# Altium project Battman.PrjPcb
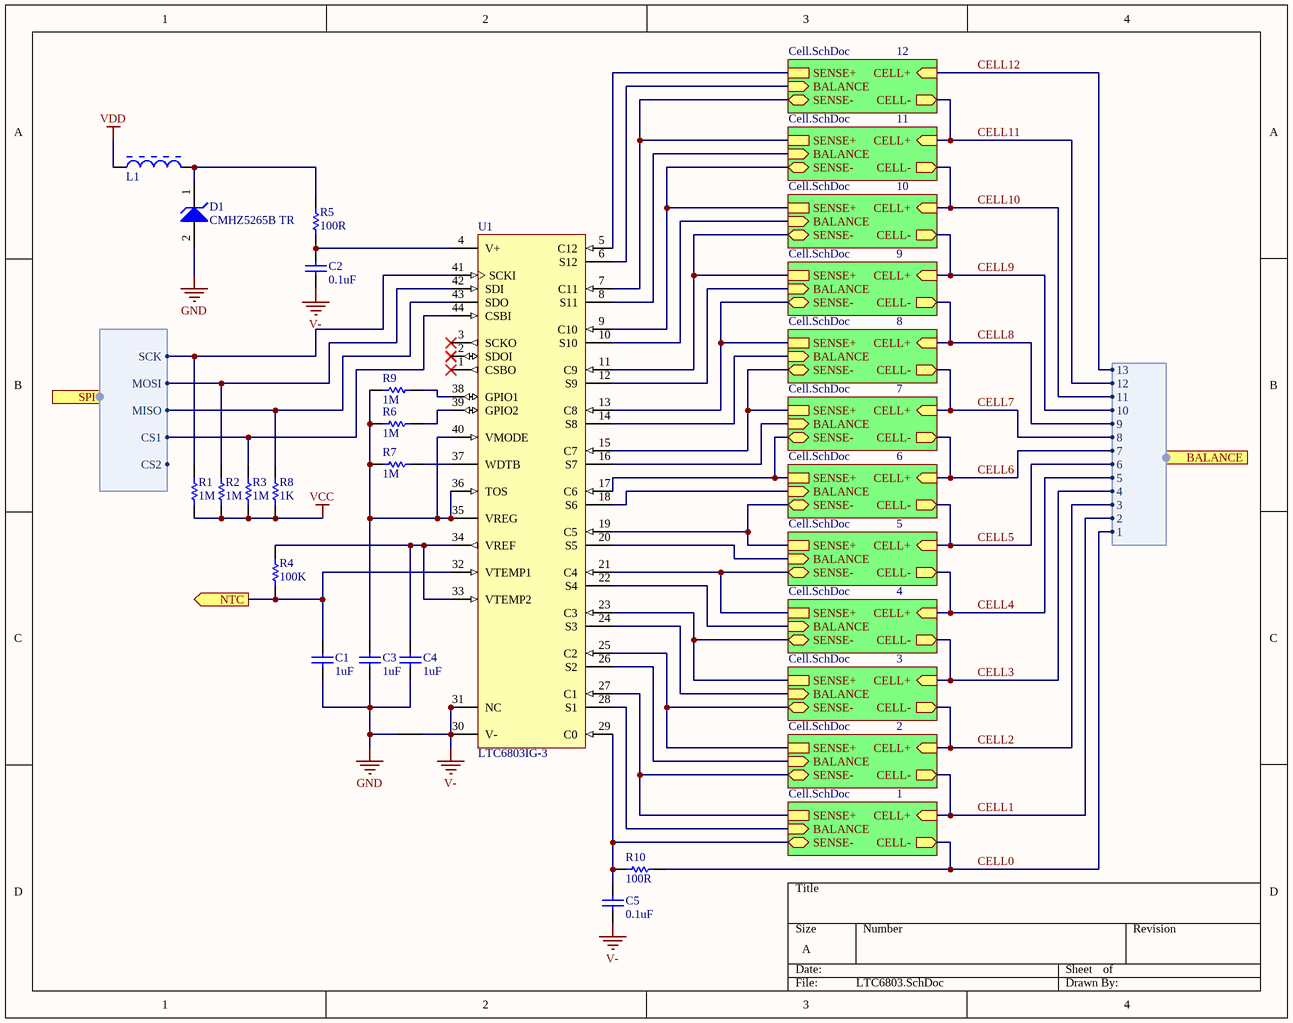
[diagram p0: LTC6803.SchDoc]
2 sheets, 39 parts. Net scope: hierarchical (ports join the sheet entries above them; power ports are global).
Board file: BMS.PcbDoc
Sheets:
  LTC6803.SchDoc
  3V3.SchDoc

## Sheet LTC6803.SchDoc
size A; SheetNumber: 4

### Parts
*  NetTie  [NetTie]  (value not drawn)  (net tie, no BOM)
C1  value 1uF  [C0402[1005X55]]  (hidden comment: 1uF 6.3V 0402)
C2  value 0.1uF  [C0402[1005X55]]  (hidden comment: 0.1uF 100V 0402)
C3  value 1uF  [C0402[1005X55]]  (hidden comment: 1uF 6.3V 0402)
C4  value 1uF  [C0402[1005X55]]  (hidden comment: 1uF 6.3V 0402)
C5  value 0.1uF  [C0402[1005X55]]  (hidden comment: 0.1uF 6.3V 0402)
D1  CMHZ5265B TR  [SOD-123]
L1  MURA-FB-2  [MURA-BLM31-B60-CHIP-2_V3]  (value not drawn)
R1  value 1M  [R0402[1005]]  (hidden comment: 1M 1% 0402)
R2  value 1M  [R0402[1005]]  (hidden comment: 1M 1% 0402)
R3  value 1M  [R0402[1005]]  (hidden comment: 1M 1% 0402)
R4  value 100K  [R0402[1005]]  (hidden comment: 100K 1% 0402)
R5  value 100R  [R0402[1005]]  (hidden comment: 100R 1% 0402)
R6  value 1M  [R0402[1005]]  (hidden comment: 1M 1% 0402)
R7  value 1M  [R0402[1005]]  (hidden comment: 1M 1% 0402)
R8  value 1K  [R0402[1005]]  (hidden comment: 1K 1% 0402)
R9  value 1M  [R0402[1005]]  (hidden comment: 1M 1% 0402)
R10  value 100R  [R0402[1005]]  (hidden comment: 100R 1% 0402)
U1  LTC6803IG-3  [TSSOP-44]

### Sub-sheets
1 = Cell.SchDoc (file not in this document): SENSE+, SENSE- (bidir), BALANCE (in), CELL+ (in), CELL- (out)
2 = Cell.SchDoc (file not in this document): SENSE+, SENSE- (bidir), BALANCE (in), CELL+ (in), CELL- (out)
3 = Cell.SchDoc (file not in this document): SENSE+, SENSE- (bidir), BALANCE (in), CELL+ (in), CELL- (out)
4 = Cell.SchDoc (file not in this document): SENSE+, SENSE- (bidir), BALANCE (in), CELL+ (in), CELL- (out)
5 = Cell.SchDoc (file not in this document): SENSE+, SENSE- (bidir), BALANCE (in), CELL+ (in), CELL- (out)
6 = Cell.SchDoc (file not in this document): SENSE+, SENSE- (bidir), BALANCE (in), CELL+ (in), CELL- (out)
7 = Cell.SchDoc (file not in this document): SENSE+, SENSE- (bidir), BALANCE (in), CELL+ (in), CELL- (out)
8 = Cell.SchDoc (file not in this document): SENSE+, SENSE- (bidir), BALANCE (in), CELL+ (in), CELL- (out)
9 = Cell.SchDoc (file not in this document): SENSE+, SENSE- (bidir), BALANCE (in), CELL+ (in), CELL- (out)
10 = Cell.SchDoc (file not in this document): SENSE+, SENSE- (bidir), BALANCE (in), CELL+ (in), CELL- (out)
11 = Cell.SchDoc (file not in this document): SENSE+, SENSE- (bidir), BALANCE (in), CELL+ (in), CELL- (out)
12 = Cell.SchDoc (file not in this document): SENSE+, SENSE- (bidir), BALANCE (in), CELL+ (in), CELL- (out)

### Ports
BALANCE (harness Balance), NTC (out), SPI (harness SPI)

### Harnesses
SPI: SCK, MOSI, MISO, CS1, CS2
Balance: 13, 12, 11, 10, 9, 8, 6, 7, 5, 3, 4, 2, 1

### Nets
GND: *.1 C1.1 C3.1 C4.1 D1.2(A)
V-: *.2 C2.1 C5.1 U1.30(V-) U1.31(NC)
VCC: R1.1 R2.1 R3.1 R8.2
VDD: L1.1
CELL0: R10.2 ; sheet 1/CELL-, port BALANCE.1
CELL1: sheet 2/CELL-, sheet 1/CELL+, port BALANCE.2
CELL2: sheet 3/CELL-, sheet 2/CELL+, port BALANCE.3
CELL3: sheet 4/CELL-, sheet 3/CELL+, port BALANCE.4
CELL4: sheet 5/CELL-, sheet 4/CELL+, port BALANCE.5
CELL5: sheet 6/CELL-, sheet 5/CELL+, port BALANCE.6
CELL6: sheet 7/CELL-, sheet 6/CELL+, port BALANCE.7
CELL7: sheet 8/CELL-, sheet 7/CELL+, port BALANCE.8
CELL8: sheet 9/CELL-, sheet 8/CELL+, port BALANCE.9
CELL9: sheet 10/CELL-, sheet 9/CELL+, port BALANCE.10
CELL10: sheet 11/CELL-, sheet 10/CELL+, port BALANCE.11
CELL11: sheet 12/CELL-, sheet 11/CELL+, port BALANCE.12
CELL12: sheet 12/CELL+, port BALANCE.13
NetC1_2: C1.2 R4.1 U1.32(VTEMP1) ; port NTC
NetC2_2: C2.2 R5.1 U1.4(V+)
NetC3_2: C3.2 R6.2 R7.2 R9.2 U1.35(VREG) U1.36(TOS) U1.40(VMODE)
NetC4_2: C4.2 R4.2 U1.33(VTEMP2) U1.34(VREF)
NetC5_2: C5.2 R10.1 U1.29(C0) ; sheet 1/SENSE-
NetD1_1: D1.1(K) L1.2 R5.2
NetR1_2: R1.2 U1.41(SCKI) ; port SPI.SCK
NetR2_2: R2.2 U1.42(SDI) ; port SPI.MOSI
NetR3_2: R3.2 U1.44(CSBI) ; port SPI.CS1
NetR6_1: R6.1 U1.39(GPIO2)
NetR7_1: R7.1 U1.37(WDTB)
NetR8_1: R8.1 U1.43(SDO) ; port SPI.MISO
NetR9_1: R9.1 U1.38(GPIO1)
NetU1_5: U1.5(C12) ; sheet 12/SENSE+
NetU1_6: U1.6(S12) ; sheet 12/BALANCE
NetU1_7: U1.7(C11) ; sheet 12/SENSE-, sheet 11/SENSE+
NetU1_8: U1.8(S11) ; sheet 11/BALANCE
NetU1_9: U1.9(C10) ; sheet 11/SENSE-, sheet 10/SENSE+
NetU1_10: U1.10(S10) ; sheet 10/BALANCE
NetU1_11: U1.11(C9) ; sheet 10/SENSE-, sheet 9/SENSE+
NetU1_12: U1.12(S9) ; sheet 9/BALANCE
NetU1_13: U1.13(C8) ; sheet 9/SENSE-, sheet 8/SENSE+
NetU1_14: U1.14(S8) ; sheet 8/BALANCE
NetU1_15: U1.15(C7) ; sheet 8/SENSE-, sheet 7/SENSE+
NetU1_16: U1.16(S7) ; sheet 7/BALANCE
NetU1_17: U1.17(C6) ; sheet 7/SENSE-, sheet 6/SENSE+
NetU1_18: U1.18(S6) ; sheet 6/BALANCE
NetU1_19: U1.19(C5) ; sheet 6/SENSE-, sheet 5/SENSE+
NetU1_20: U1.20(S5) ; sheet 5/BALANCE
NetU1_21: U1.21(C4) ; sheet 5/SENSE-, sheet 4/SENSE+
NetU1_22: U1.22(S4) ; sheet 4/BALANCE
NetU1_23: U1.23(C3) ; sheet 4/SENSE-, sheet 3/SENSE+
NetU1_24: U1.24(S3) ; sheet 3/BALANCE
NetU1_25: U1.25(C2) ; sheet 3/SENSE-, sheet 2/SENSE+
NetU1_26: U1.26(S2) ; sheet 2/BALANCE
NetU1_27: U1.27(C1) ; sheet 2/SENSE-, sheet 1/SENSE+
NetU1_28: U1.28(S1) ; sheet 1/BALANCE

Not connected (* = marked no-connect by the designer): U1 1(CSBO)* 2(SDOI)* 3(SCKO)*

### Library data of the parts
C1 C3 C4 = CAP_1uF_6.3V_0402_10%: 1uF 6.3V 10% 0402 (1005 Metric); PartNumber: GRM155R70J105KA12D; Manufacturer: Murata; Tolerance: 10%; Mounting Technology: Surface Mount; PackageReference: 0402; PackageDescription: 0402 (1005 Metric); Voltage: 6.3V
C2 = CAP_0.1uF_100V_0402_10%: 0.1uF 100V 10% 0402 (1005 Metric); PartNumber: GRM155R62A104KE14D; Manufacturer: Murata; Tolerance: 10%; Mounting Technology: Surface Mount; PackageReference: 0402; PackageDescription: 0402 (1005 Metric); Voltage: 100V
C5 = CAP_0.1uF_6.3V_0402_10%: 0.1uF 6.3V 10% 0402 (1005 Metric); PartNumber: GRM155R70J104KA01D; Manufacturer: Murata; Tolerance: 10%; Mounting Technology: Surface Mount; PackageReference: 0402; PackageDescription: 0402 (1005 Metric); Voltage: 6.3V
D1 = CMHZ5265B: Zener Diodes 500mW Zener Diode 185mA 58.9V to 2V; Manufacturer: Central Semiconductor; PartNumber: CMHZ5265B TR; Mounting Technology: Surface Mount; PackageReference: SOD-123; PackageDescription: SOD, 2-Leads, Body 2.69x1.6mm
L1 = MURA-FB-2: EMI Filter Beads, Chips & Arrays 1206 33 OHM; PartNumber: BLM31PG330SN1L; Manufacturer: Murata; Mounting Technology: Surface Mount; PackageReference: 1206; PackageDescription: 1206 (3216 Metric)
R1-R3 R6 R7 R9 = RES_1M_0402_1%: 1M 0.063W 1% 0402 (1005 Metric); Manufacturer: KOA Speer; PartNumber: RK73H1ETTP1004F; Power: 0.063W; Tolerance: 1%; Mounting Technology: Surface Mount; PackageReference: 0402; PackageDescription: 0402 (1005 Metric); ComponentLink1Description: Datasheet; ComponentLink1URL: http://www.koaspeer.com/catimages/Products/RK73H/RK73H.pdf
R4 = RES_100K_0402_1%: 100K 0.063W 1% 0402 (1005 Metric); Manufacturer: KOA Speer; PartNumber: RK73H1ETTP1003F; Power: 0.063W; Tolerance: 1%; Mounting Technology: Surface Mount; PackageReference: 0402; PackageDescription: 0402 (1005 Metric); ComponentLink1Description: Datasheet; ComponentLink1URL: http://www.koaspeer.com/catimages/Products/RK73H/RK73H.pdf
R5 R10 = RES_100R_0402_1%: 100R 0.063W 1% 0402 (1005 Metric); Manufacturer: KOA Speer; PartNumber: RK73H1ETTP1000F; Power: 0.063W; Tolerance: 1%; Mounting Technology: Surface Mount; PackageReference: 0402; PackageDescription: 0402 (1005 Metric); ComponentLink1Description: Datasheet; ComponentLink1URL: http://www.koaspeer.com/catimages/Products/RK73H/RK73H.pdf
R8 = RES_1K_0402_1%: 1K 0.063W 1% 0402 (1005 Metric); Manufacturer: KOA Speer; PartNumber: RK73H1ETTP1001F; Tolerance: 1%; Power: 0.063W; Mounting Technology: Surface Mount; PackageReference: 0402; PackageDescription: 0402 (1005 Metric); ComponentLink1Description: Datasheet; ComponentLink1URL: http://www.koaspeer.com/catimages/Products/RK73H/RK73H.pdf
U1 = LTC6803IG-3: PartNumber: LTC6803IG-3#PBF; Manufacturer: Linear Technology; PackageReference: TSSOP-44; Mounting Technology: Surface Mount; PackageDescription: SOP, 44-Leads, Body 13.1x5.6mm, Pitch 0.5mm

## Sheet 3V3.SchDoc
size A; SheetNumber: 2
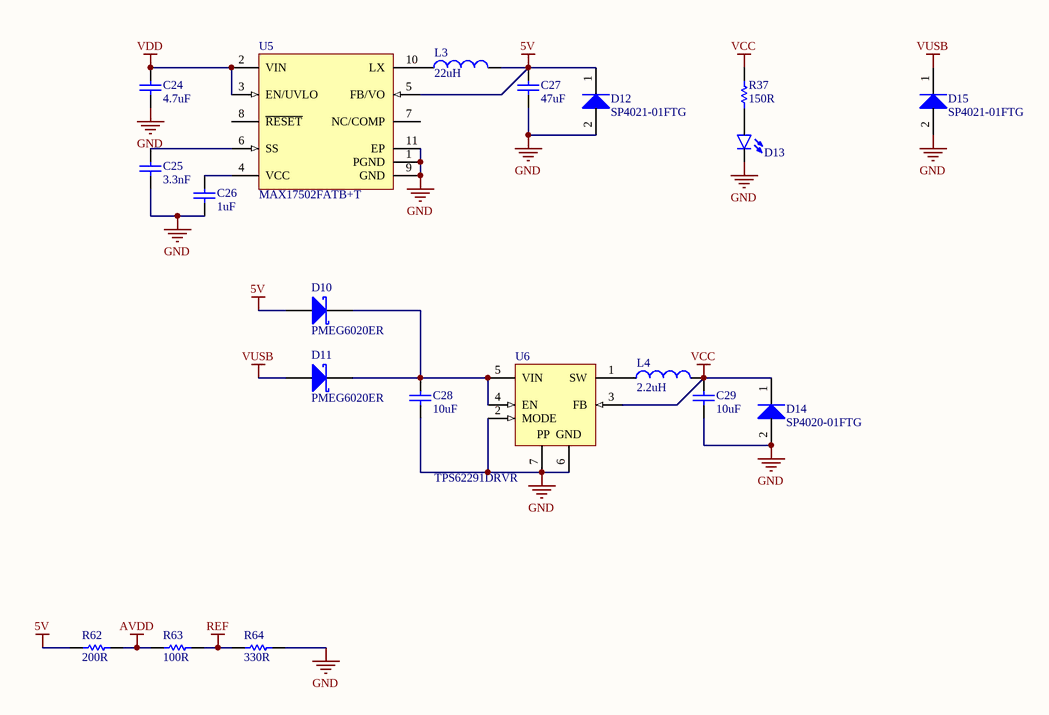
[diagram p1: 3V3.SchDoc]

### Parts
C24  value 4.7uF  [C1210[3225X200]]  (hidden comment: 4.7uF 100V 1210)
C25  value 3.3nF  [C0402[1005X55]]  (hidden comment: 3.3nF 50V 0402)
C26  value 1uF  [C0402[1005X55]]  (hidden comment: 1uF 6.3V 0402)
C27  value 47uF  [C1210[3225X250]]  (hidden comment: 47uF 6.3V 1210)
C28  value 10uF  [C0402[1005X55]]  (hidden comment: 10uF 6.3V 0402)
C29  value 10uF  [C0402[1005X55]]  (hidden comment: 10uF 6.3V 0402)
D10  PMEG6020ER  [SOD-123]
D11  PMEG6020ER  [SOD-123]
D12  SP4021-01FTG  [SOD-323]
D13  LED_0603_GREEN_5mA  [LED0603]  (value not drawn)
D14  SP4020-01FTG  [SOD323]
D15  SP4021-01FTG  [SOD-323]
L3  value 22uH  [SDR0604]
L4  2.2uH  [IND0805]
R37  value 150R  [R0402[1005]]  (hidden comment: 150R 1% 0402)
R62  value 200R  [R0603[1608]]  (hidden comment: 200R 1% 0603)
R63  value 100R  [R0603[1608]]  (hidden comment: 100R 1% 0603)
R64  value 330R  [R0603[1608]]  (hidden comment: 330R 1% 0603)
U5  MAX17502FATB+T  [TDFN-10-EP]
U6  TPS62291DRVR  [WSON-6]

### Nets
5V: C27.2 D10.2(A) D12.1(K) L3.2 R62.1 U5.5(FB/VO)
AVDD: R62.2 R63.1
GND: C24.1 C25.1 C26.1 C27.1 C28.1 C29.1 D12.2(A) D13.C D14.2(A) D15.2(A) R64.2 U5.1(PGND) U5.9(GND) U5.11(EP) U6.2(MODE) U6.6(GND) U6.7(EP)
REF: R63.2 R64.1
VCC: C29.2 D14.1(K) L4.2 R37.2 U6.3(FB)
VDD: C24.2 U5.2(VIN) U5.3(EN/UVLO)
VUSB: D11.2(A) D15.1(K)
NetC25_2: C25.2 U5.6(SS)
NetC26_2: C26.2 U5.4(VCC)
NetC28_2: C28.2 D10.1(K) D11.1(K) U6.4(EN) U6.5(VIN)
NetD13_A: D13.A R37.1
NetL3_1: L3.1 U5.10(LX)
NetL4_1: L4.1 U6.1(SW)

Not connected (* = marked no-connect by the designer): U5 7(NC/COMP) 8(~{RESET})

### Notes on the sheet
- (in symbol TPS62291DRVR) PP

### Library data of the parts
C24 = CAP_4.7uF_100V_1210_10%: 4.7uF 100V 10% 1210 (3225 Metric); PartNumber: GRJ32DC72A475KE11L; Manufacturer: Murata; Tolerance: 10%; Mounting Technology: Surface Mount; PackageReference: 1210; PackageDescription: 1210 (3225 Metric); Voltage: 100V
C25 = CAP_3.3nF_50V_0402_10%: 3.3nF 50V 10% 0402 (1005 Metric); PartNumber: GRM155R71H332KA01D; Manufacturer: Murata; Tolerance: 10%; Mounting Technology: Surface Mount; PackageReference: 0402; PackageDescription: 0402 (1005 Metric); Voltage: 50V
C26 = CAP_1uF_6.3V_0402_10%: as C1 on sheet LTC6803; Tolerance: 10%; Mounting Technology: Surface Mount; PackageReference: 0402; PackageDescription: 0402 (1005 Metric); Voltage: 6.3V
C27 = CAP_47uF_6.3V_1210_10%: 47uF 6.3V 10% 1210 (3225 Metric); PartNumber: GRM32ER70J476KE20L; Manufacturer: Murata; Tolerance: 10%; Mounting Technology: Surface Mount; PackageReference: 1210; PackageDescription: 1210 (3225 Metric); Voltage: 6.3V
C28 C29 = CAP_10uF_6.3V_0402_20%: 10uF 6.3V 20% 0402 (1005 Metric); PartNumber: GRM155R60J106ME44D; Manufacturer: Murata; Tolerance: 20%; Mounting Technology: Surface Mount; PackageReference: 0402; PackageDescription: 0402 (1005 Metric); Voltage: 6.3V
D10 D11 = PMEG6020ER: PartNumber: PMEG6020ER,115; Manufacturer: NXP Semiconductors; PackageReference: SOD-123W; PackageDescription: SOD, 2-Leads, Body 2.69x1.6mm; Mounting Technology: Surface Mount
D12 D15 = SP4021-01FTG: Manufacturer: Littelfuse; PartNumber: SP4021-01FTG; PackageReference: SOD-323-2; Mounting Technology: Surface Mount
D13 = LED_0603_GREEN_5mA: PartNumber: LTST-C193TGKT-5A; Manufacturer: Lite-On Inc.; PackageReference: 0603; PackageDescription: 0603 (1608 Metric); Mounting Technology: Surface Mount
D14 = SP4020-01FTG: Manufacturer: Littelfuse; PartNumber: SP4020-01FTG; PackageReference: SOD-323-2; Mounting Technology: Surface Mount
L3 = SDR0604-220YL: 22uH 30% 1.1A 0604; Manufacturer: Bourns; PartNumber: SDR0604-220YL; PackageReference: SDR0604; Mounting Technology: Surface Mount
L4 = IND_2.2uH_1.7A_0805_20%: 2.2uH 20% 1.7A 0805; PartNumber: LQM21PN2R2MGHL; Manufacturer: Murata; PackageReference: 0805; PackageDescription: 0805 (2012 metric); Value: 2.2uH; Mounting Technology: Surface Mount; Current: 1.7A
R37 = RES_150R_0402_1%: 150R 0.063W 1% 0402 (1005 Metric); Manufacturer: KOA Speer; PartNumber: RK73H1ETTP1500F; Power: 0.063W; Tolerance: 1%; Mounting Technology: Surface Mount; PackageReference: 0402; PackageDescription: 0402 (1005 Metric); ComponentLink1Description: Datasheet; ComponentLink1URL: http://www.koaspeer.com/catimages/Products/RK73H/RK73H.pdf
R62 = RES_200R_0603_1%: 200R 0.25W 1% 0603 (1005 Metric); Manufacturer: Vishay / Dale; Tolerance: 1%; Power: 0.25W; Mounting Technology: Surface Mount; PackageReference: 0603; PackageDescription: 0603 (1608 Metric); ComponentLink1Description: Datasheet; ComponentLink1URL: http://www.vishay.com/docs/20043/crcwhpe3.pdf
R63 = RES_100R_0603_1%: 100R 0.25W 1% 0603 (1005 Metric); Manufacturer: Vishay / Dale; Tolerance: 1%; Power: 0.25W; Mounting Technology: Surface Mount; PackageReference: 0603; PackageDescription: 0603 (1608 Metric); ComponentLink1Description: Datasheet; ComponentLink1URL: http://www.vishay.com/docs/20043/crcwhpe3.pdf
R64 = RES_330R_0603_1%: 330R 0.25W 1% 0603 (1005 Metric); Manufacturer: Vishay / Dale; Tolerance: 1%; Power: 0.25W; Mounting Technology: Surface Mount; PackageReference: 0603; PackageDescription: 0603 (1608 Metric); ComponentLink1Description: Datasheet; ComponentLink1URL: http://www.vishay.com/docs/20043/crcwhpe3.pdf
U5 = MAX17502FATB+T: Ultra-Small, High-Efficiency, Synchronous Step-Down DC-DC Converter, 4.5 to 60 V, 1 A, -40 to 125 degC, 10-Pin TDFN (T1032N+1), RoHS, Tape and Reel; Manufacturer: Maxim Integrated; Mounting Technology: Surface Mount; PartNumber: MAX17502FATB+T; PackageReference: TDFN-10-EP
U6 = TPS62291DRVR: Voltage Regulators - Switching Regulators 2.25MHz 1A Step-Down Cnvrtr 3.3V Output; Manufacturer: Texas Instruments; PartNumber: TPS62291DRVR; PackageReference: WSON-6; PackageDescription: SON, 6-Leads, Body 2x2mm, Pitch 0.65mm, Thermal Pad 1.6x1mm, TI Recommended; Mounting Technology: Surface Mount

## Nets that join several sheets
GND: LTC6803 (5 pins), 3V3 (17 pins)
VCC: LTC6803 (R1.1 R2.1 R3.1 R8.2), 3V3 (5 pins)
VDD: LTC6803 (L1.1), 3V3 (C24.2 U5.2 U5.3)